# Altium project SLAVE_HW.PrjPcb (part 1 of 3)
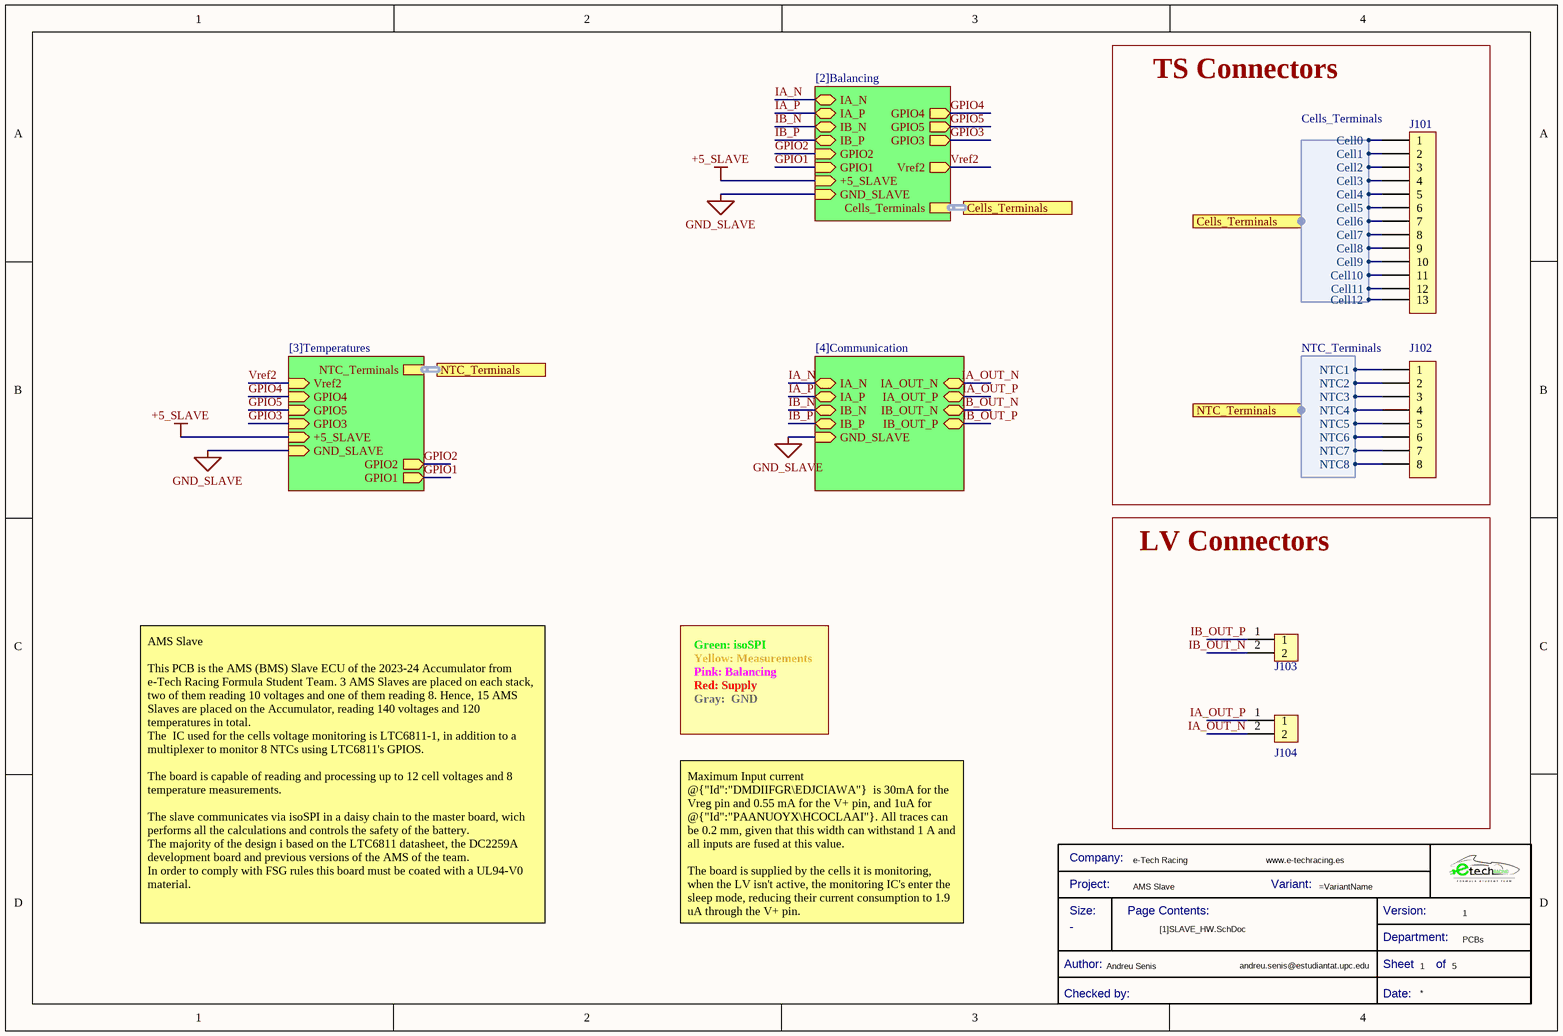
[diagram p0: [1]SLAVE_HW.SchDoc]
Company: e-Tech Racing; Department: PCBs; DesignedbyURL: www.e-techracing.es; DesignerMail: andreu.senis@estudiantat.upc.edu; DesignerName: Andreu Senis; Project: AMS Slave; Version: 1
4 sheets, 172 parts. Net scope: hierarchical (ports join the sheet entries above them; power ports are global).
Board file: SLAVE_HW.PcbDoc
Sheets:
  [1]SLAVE_HW.SchDoc
    Balancing = [2]Balancing.SchDoc
    Temperatures = [3]Temperatures.SchDoc
    Communication = [4]Communication.SchDoc

## Sheet [1]SLAVE_HW.SchDoc
size A4; DocumentNumber: 1; SheetNumber: 1; SheetTotal: 5

### Parts
(Parts that share a designator on the sheet are numbered #1, #2 ... from top to bottom, then left to right.)
*#1  Title Block_template  (value not drawn)  (graphical)
J101  61301311121  [J_Pinheader_1x13]  (value not drawn)
J102  61301211121  [J_Pinheader_1x8]  (value not drawn)
J103  436500215  [J_MicroFit_2x1]  (value not drawn)
J104  436500215  [J_MicroFit_2x1]  (value not drawn)

### Blocks framed on the sheet
TS Connectors: J101 J102
LV Connectors: J103 J104

### Sub-sheets
Balancing = [2]Balancing: GPIO4 (out), GPIO5 (out), GPIO1 (in), +5_SLAVE (in), GND_SLAVE (in), IA_N (bidir), IA_P (bidir), IB_N (bidir), IB_P (bidir), GPIO3 (out), Vref2 (out), Cells_Terminals (harness Cells_Terminals), GPIO2 (in)
Communication = [4]Communication: IA_OUT_N (bidir), IA_OUT_P (bidir), IB_OUT_N (bidir), IB_OUT_P (bidir), IA_N (bidir), IA_P (bidir), IB_N (bidir), IB_P (bidir), GND_SLAVE (in)
Temperatures = [3]Temperatures: GPIO4 (in), GPIO5 (in), +5_SLAVE (in), GND_SLAVE (in), GPIO1 (out), GPIO3 (in), Vref2 (in), NTC_Terminals (harness NTC_Terminals), GPIO2 (out)

### Ports
Cells_Terminals (harness Cells_Terminals), NTC_Terminals (harness NTC_Terminals)

### Harnesses
Cells_Terminals: Cell0, Cell1, Cell2, Cell3, Cell4, Cell5, Cell6, Cell7, Cell8, Cell9, Cell10, Cell11, Cell12
NTC_Terminals: NTC1, NTC2, NTC3, NTC4, NTC5, NTC6, NTC7, NTC8

### Nets
+5_SLAVE: sheet Balancing/+5_SLAVE, sheet Temperatures/+5_SLAVE  [project net Vreg]
GND_SLAVE: sheet Balancing/GND_SLAVE, sheet Temperatures/GND_SLAVE, sheet Communication/GND_SLAVE
Cell0: J101.1 ; port Cells_Terminals.Cell0
Cell1: J101.2 ; port Cells_Terminals.Cell1
Cell2: J101.3 ; port Cells_Terminals.Cell2
Cell3: J101.4 ; port Cells_Terminals.Cell3
Cell4: J101.5 ; port Cells_Terminals.Cell4
Cell5: J101.6 ; port Cells_Terminals.Cell5
Cell6: J101.7 ; port Cells_Terminals.Cell6
Cell7: J101.8 ; port Cells_Terminals.Cell7
Cell8: J101.9 ; port Cells_Terminals.Cell8
Cell9: J101.10 ; port Cells_Terminals.Cell9
Cell10: J101.11 ; port Cells_Terminals.Cell10
Cell11: J101.12 ; port Cells_Terminals.Cell11
Cell12: J101.13 ; port Cells_Terminals.Cell12
GPIO1: sheet Balancing/GPIO1, sheet Temperatures/GPIO1
GPIO2: sheet Balancing/GPIO2, sheet Temperatures/GPIO2
GPIO3: sheet Balancing/GPIO3, sheet Temperatures/GPIO3
GPIO4: sheet Balancing/GPIO4, sheet Temperatures/GPIO4
GPIO5: sheet Balancing/GPIO5, sheet Temperatures/GPIO5
IA_N: sheet Balancing/IA_N, sheet Communication/IA_N
IA_OUT_N: J104.2 ; sheet Communication/IA_OUT_N
IA_OUT_P: J104.1 ; sheet Communication/IA_OUT_P
IA_P: sheet Balancing/IA_P, sheet Communication/IA_P
IB_N: sheet Balancing/IB_N, sheet Communication/IB_N
IB_OUT_N: J103.2 ; sheet Communication/IB_OUT_N
IB_OUT_P: J103.1 ; sheet Communication/IB_OUT_P
IB_P: sheet Balancing/IB_P, sheet Communication/IB_P
NTC1: J102.1 ; port NTC_Terminals.NTC1
NTC2: J102.2 ; port NTC_Terminals.NTC2
NTC3: J102.3 ; port NTC_Terminals.NTC3
NTC4: J102.4 ; port NTC_Terminals.NTC4
NTC5: J102.5 ; port NTC_Terminals.NTC5
NTC6: J102.6 ; port NTC_Terminals.NTC6
NTC7: J102.7 ; port NTC_Terminals.NTC7
NTC8: J102.8 ; port NTC_Terminals.NTC8
Vref2: sheet Balancing/Vref2, sheet Temperatures/Vref2

### Buses and harness runs
harness port Cells_Terminals = sheet Balancing/Cells_Terminals
harness port NTC_Terminals = sheet Temperatures/NTC_Terminals

### Notes on the sheet
- Green: isoSPI
- Red: Supply
- Yellow: Measurements
- Pink: Balancing
- Gray:  GND
- AMS Slave
  This PCB is the AMS (BMS) Slave ECU of the 2023-24 Accumulator from e-Tech Racing Formula Student Team. 3 AMS Slaves are placed on each stack, two of them reading 10 voltages and one of them reading 8. Hence, 15 AMS Slaves are placed on the Accumulator, reading 140 voltages and 120 temperatures in total.                                                                                                                                                                                                                              The  IC used for the cells voltage monitoring is LTC6811-1, in addition to a multiplexer to monitor 8 NTCs using LTC6811's GPIOS.
  The board is capable of reading and processing up to 12 cell voltages and 8 temperature measurements.
  The slave communicates via isoSPI in a daisy chain to the master board, wich performs all the calculations and controls the safety of the battery.                                                                                                                                                  The majority of the design i based on the LTC6811 datasheet, the DC2259A development board and previous versions of the AMS of the team.                                                                                                                                                     In order to comply with FSG rules this board must be coated with a UL94-V0 material.
- Maximum Input current @{"Id":"DMDIIFGR\EDJCIAWA"}  is 30mA for the Vreg pin and 0.55 mA for the V+ pin, and 1uA for @{"Id":"PAANUOYX\HCOCLAAI"}. All traces can be 0.2 mm, given that this width can withstand 1 A and all inputs are fused at this value.
  The board is supplied by the cells it is monitoring, when the LV isn't active, the monitoring IC's enter the sleep mode, reducing their current consumption to 1.9 uA through the V+ pin.
- (in symbol Title Block_template) Company:; Project:; Variant:; Size:; Page Contents:; Version:; Department:; Author:; Sheet; of; Checked by:; Date:

### Library data of the parts
*#1 = Title Block_template: Standard Title Block; .Creator: GP; Category: Title Block; .PCBcheck: GP; .SCHcheck: GP; Size: -
J101 = J_Pinheader_1x13: THT Vertical Pin Header WR-PHD, Pitch 2.54 mm, Single Row, 13 pins; Manufacturer 1: Wurth Electronics; Manufacturer Part Number 1: 61301211121; Number of Positions: 12; Gender: Male; Connector Type: Male Pin; Pitch: 0.1inch; Supplier 1: Digi-Key; RoHS: Yes; Category: Connectors; Stock 1: 2124; Pricing 1: 1=0,57000, 10=0,48400, 25=0,40400, 50=0,33700, 100=0,30600, 1000=0,27800 (USD); Mount: Through Hole; Contact Plating: Gold; Contact Material: Copper; Color: Black; Number of Rows: 1; Packaging: Bulk; Termination: Solder; Number of Contacts: 12; Contact Mating Length: 0.236inch; REACH SVHC: Unknown; RoHS Compliant: Yes; ComponentLink1URL: http://www.farnell.com/cad/1737268.pdf?src-supplier=Element14; ComponentLink1Description: http://www.farnell.com/cad/1737268.pdf?src-supplier=Element14; ComponentLink2URL: https://katalog.we-online.de/em/datasheet/6130xx11121.pdf?src-supplier=Digi-Key; ComponentLink2Description: https://katalog.we-online.de/em/datasheet/6130xx11121.pdf?src-supplier=Digi-Key; Supplier 2: Rs; Manufacturer: Wurth Electronics; Manufacturer Part Number: 61301311121; Stock 2: 70; Pricing 2: 5=0,73, 100=0,38, 375=0,36, 1500=0,344, 3000=0,324 (EUR); Mounting Technology: Through Hole; Series: WR-PHD; Contact Type: Male Pin; Lead Free: Lead Free; Reach SVHC Compliant: Unknown; Supplier Part Number 2: 8281610
J102 = J_Pinheader_1x8: THT Vertical Pin Header WR-PHD, Pitch 2.54 mm, Single Row, 12 pins; Manufacturer 1: Wurth Electronics; Number of Positions: 12; Gender: Male; Connector Type: Male Pin; Pitch: 0.1inch; Supplier 1: Digi-Key; Manufacturer Part Number 1: 61301211121; RoHS: Yes; Category: Connectors; Stock 1: 2124; Pricing 1: 1=0,57000, 10=0,48400, 25=0,40400, 50=0,33700, 100=0,30600, 1000=0,27800 (USD); Mount: Through Hole; Contact Plating: Gold; Contact Material: Copper; Color: Black; Number of Rows: 1; Packaging: Bulk; Termination: Solder; Number of Contacts: 12; Contact Mating Length: 0.236inch; REACH SVHC: Unknown; RoHS Compliant: Yes; ComponentLink1URL: http://www.farnell.com/cad/1737268.pdf?src-supplier=Element14; ComponentLink1Description: http://www.farnell.com/cad/1737268.pdf?src-supplier=Element14; ComponentLink2URL: https://katalog.we-online.de/em/datasheet/6130xx11121.pdf?src-supplier=Digi-Key; ComponentLink2Description: https://katalog.we-online.de/em/datasheet/6130xx11121.pdf?src-supplier=Digi-Key
J103 J104 = J_MicroFit_2x1: Header 1 Row Vertical Polarizing Peg 2 Pin SMT/Glow Wire Compatible Tin Plate; Manufacturer 1: Molex; Manufacturer Part Number 1: 43650-0215; Supplier 1: Arrow Electronics; RoHS: Yes; Category: Headers and Wire Housings; Stock 1: 11086; Pricing 1: 1=0,87800, 10=0,74400, 80=0,63070, 3264=0,47000, 6528=0,45100, 13056=0,41760 (USD); ComponentLink1URL: https://datasheet.ciiva.com/19462/884109-19462034.pdf?src-supplier=Jameco; ComponentLink1Description: https://datasheet.ciiva.com/19462/884109-19462034.pdf?src-supplier=Jameco; ComponentLink2URL: https://datasheet.ciiva.com/5157/0436500215-pcb-headers-148687-5157608.pdf?src-supplier=Mouser; ComponentLink2Description: https://datasheet.ciiva.com/5157/0436500215-pcb-headers-148687-5157608.pdf?src-supplier=Mouser; ComponentLink3URL: https://datasheet.ciiva.com/16085/0436500215-pcb-headers-16085668.pdf?src-supplier=Onlinecomponents.com; ComponentLink3Description: https://datasheet.ciiva.com/16085/0436500215-pcb-headers-16085668.pdf?src-supplier=Onlinecomponents.com; ComponentLink4URL: https://datasheet.ciiva.com/11748/0900766b80307ce2-11748388.pdf?src-supplier=RSComponents; ComponentLink4Description: https://datasheet.ciiva.com/11748/0900766b80307ce2-11748388.pdf?src-supplier=RSComponents; ComponentLink5URL: https://datasheet.ciiva.com/9432/0436500215-pcb-headers-9432850.pdf?src-supplier=Avnet; ComponentLink5Description: https://datasheet.ciiva.com/9432/0436500215-pcb-headers-9432850.pdf?src-supplier=Avnet; ComponentLink6URL: https://datasheet.ciiva.com/7920/1889390-7920892.pdf?src-supplier=Element14; ComponentLink6Description: https://datasheet.ciiva.com/7920/1889390-7920892.pdf?src-supplier=Element14; Supplier Part Number 1: 43650-0215